# Altium schematic sheet Block-scheme.SchDoc
size 594 x 420 mm; SheetNumber: 1; SheetTotal: 2
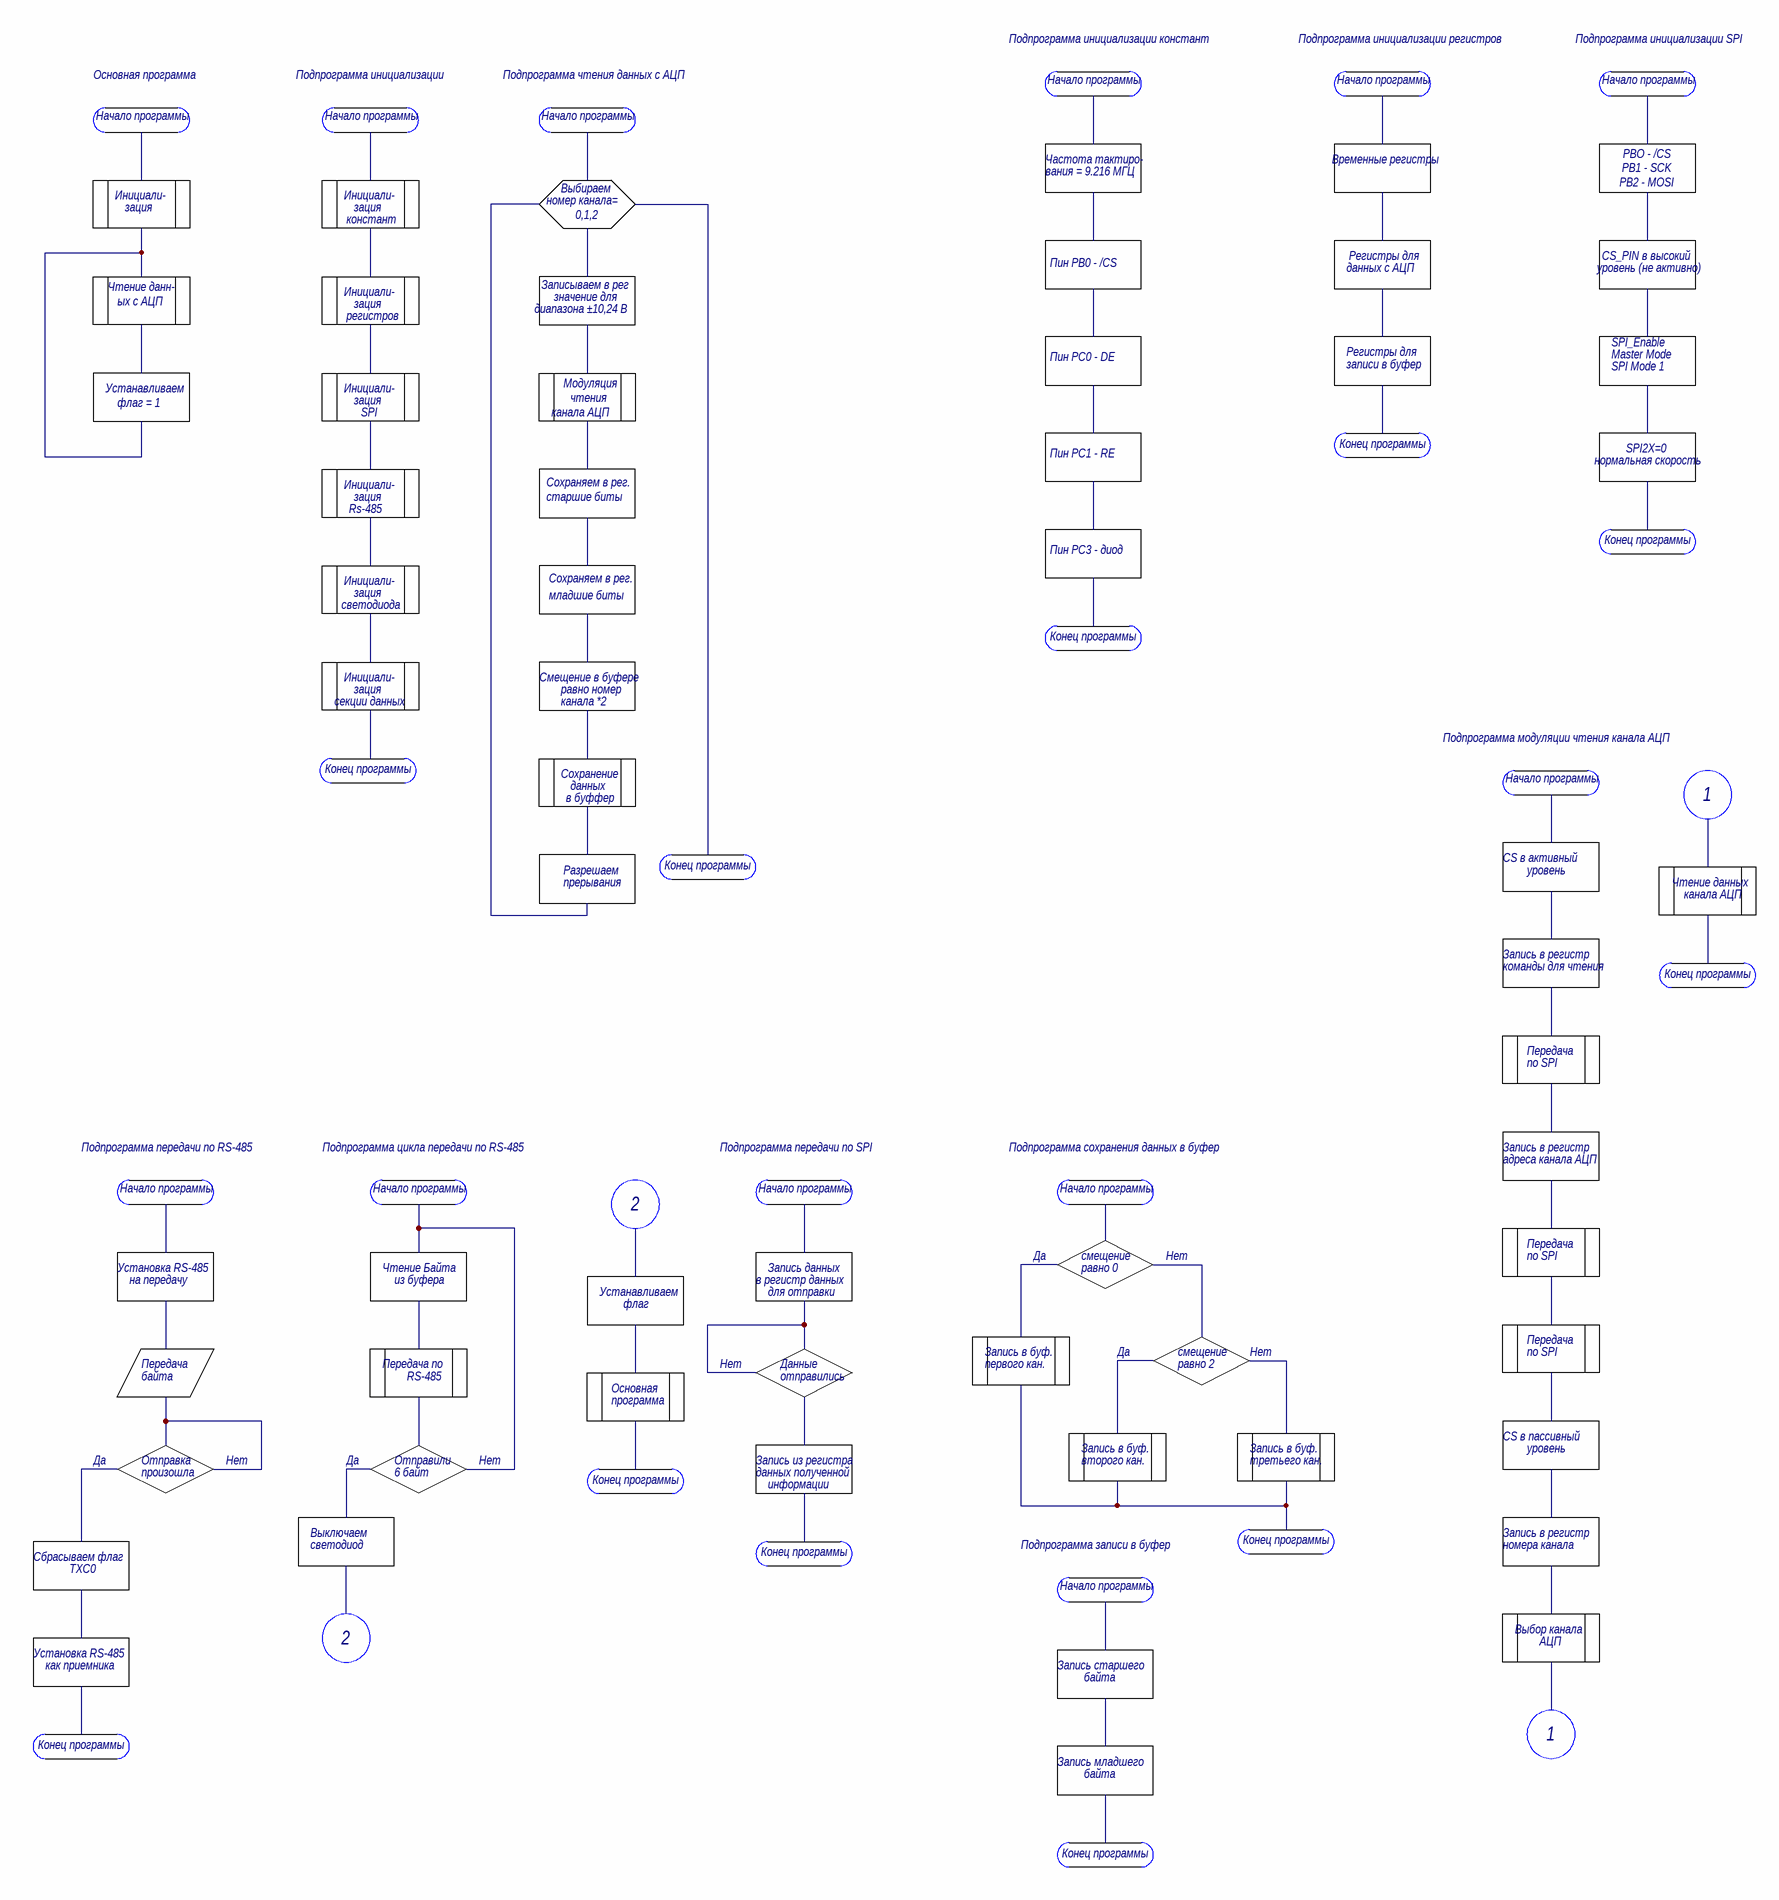
[diagram p0: Block-scheme.SchDoc, left]
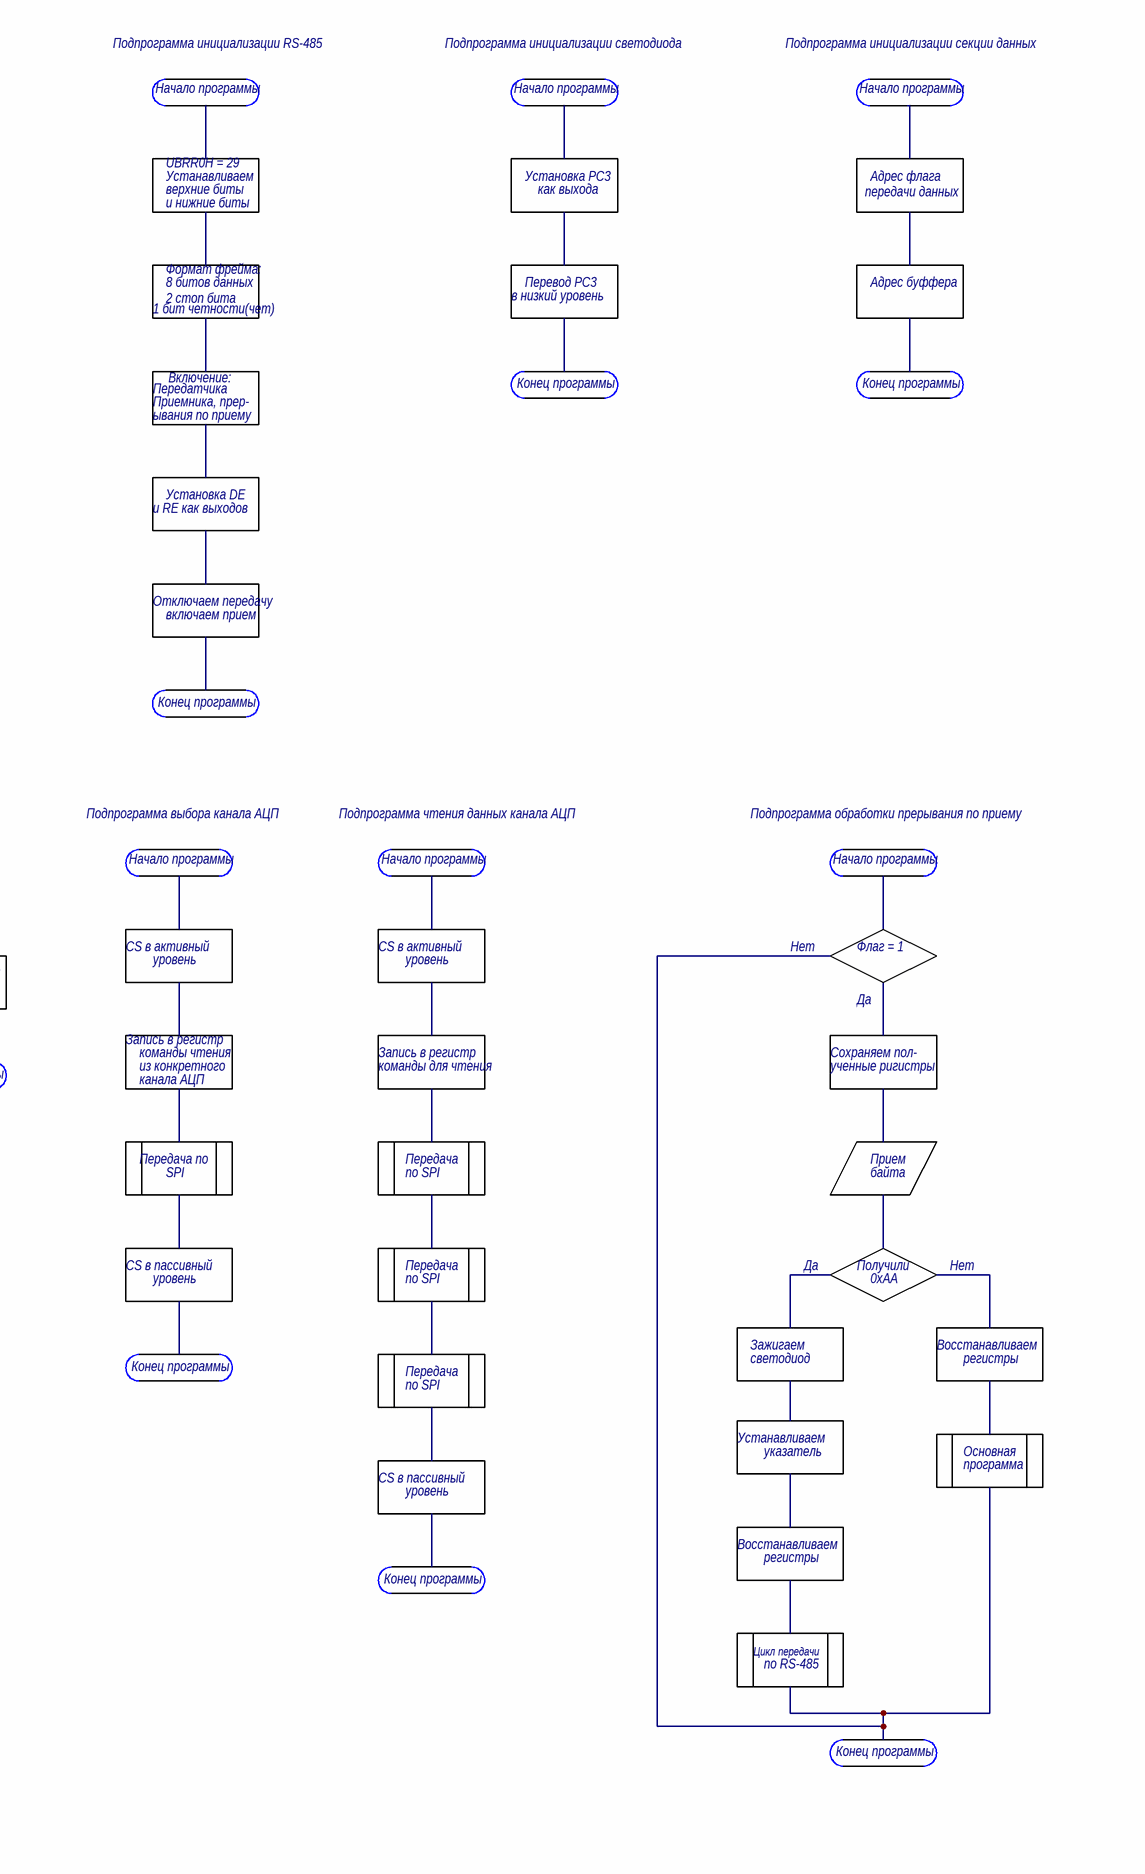
[diagram p1: Block-scheme.SchDoc, right]

## Parts
(Parts that share a designator on the sheet are numbered #1, #2 ... from top to bottom, then left to right.)
A1  Activity  (value not drawn)
A2  Activity  (value not drawn)
A3  Activity  (value not drawn)
A4  Activity  (value not drawn)
A5  Activity  (value not drawn)
A6  Activity  (value not drawn)
A7  Activity  (value not drawn)
A8  Activity  (value not drawn)
A9  Activity  (value not drawn)
A10  Activity  (value not drawn)
A11  Activity  (value not drawn)
A12  Activity  (value not drawn)
A13  Activity  (value not drawn)
A14  Activity  (value not drawn)
A16  Activity  (value not drawn)
A17  Activity  (value not drawn)
A18  Activity  (value not drawn)
A19  Activity  (value not drawn)
A20  Activity  (value not drawn)
A21  Activity  (value not drawn)
A22  Activity  (value not drawn)
A23  Activity  (value not drawn)
A24  Activity  (value not drawn)
A25  Activity  (value not drawn)
A26  Activity  (value not drawn)
A27  Activity  (value not drawn)
A28  Activity  (value not drawn)
A29  Activity  (value not drawn)
A30  Activity  (value not drawn)
A31  Activity  (value not drawn)
A32  Activity  (value not drawn)
A33  Activity  (value not drawn)
A34  Activity  (value not drawn)
A35  Activity  (value not drawn)
A?#1  Activity  (value not drawn)
A?#2  Activity  (value not drawn)
A?#3  Activity  (value not drawn)
A?#4  Activity  (value not drawn)
A?#5  Activity  (value not drawn)
A?#6  Activity  (value not drawn)
A?#7  Activity  (value not drawn)
A?#8  Activity  (value not drawn)
A?#9  Activity  (value not drawn)
A?#10  Activity  (value not drawn)
A?#11  Activity  (value not drawn)
A?#12  Activity  (value not drawn)
A?#13  Activity  (value not drawn)
A?#14  Activity  (value not drawn)
A?#15  Activity  (value not drawn)
A?#16  Activity  (value not drawn)
A?#17  Activity  (value not drawn)
A?#18  Activity  (value not drawn)
A?#19  Activity  (value not drawn)
CO1  connector  (value not drawn)
CO2  connector  (value not drawn)
CO?#1  connector  (value not drawn)
CO?#2  connector  (value not drawn)
CON2  Condition  (value not drawn)
CON3  Condition  (value not drawn)
CON4  Condition  (value not drawn)
CON?#1  Condition  (value not drawn)
CON?#2  Condition  (value not drawn)
CON?#3  Condition  (value not drawn)
CON?#4  Condition  (value not drawn)
CY1  Cycle  (value not drawn)
E1  End/Begin  (value not drawn)
E2  End/Begin  (value not drawn)
E3  End/Begin  (value not drawn)
E4  End/Begin  (value not drawn)
E5  End/Begin  (value not drawn)
E6  End/Begin  (value not drawn)
E7  End/Begin  (value not drawn)
E8  End/Begin  (value not drawn)
E9  End/Begin  (value not drawn)
E10  End/Begin  (value not drawn)
E11  End/Begin  (value not drawn)
E12  End/Begin  (value not drawn)
E13  End/Begin  (value not drawn)
E14  End/Begin  (value not drawn)
E15  End/Begin  (value not drawn)
E16  End/Begin  (value not drawn)
E17  End/Begin  (value not drawn)
E18  End/Begin  (value not drawn)
E19  End/Begin  (value not drawn)
E21  End/Begin  (value not drawn)
E22  End/Begin  (value not drawn)
E23  End/Begin  (value not drawn)
E24  End/Begin  (value not drawn)
E25  End/Begin  (value not drawn)
E26  End/Begin  (value not drawn)
E27  End/Begin  (value not drawn)
E28  End/Begin  (value not drawn)
E?#1  End/Begin  (value not drawn)
E?#2  End/Begin  (value not drawn)
E?#3  End/Begin  (value not drawn)
E?#4  End/Begin  (value not drawn)
E?#5  End/Begin  (value not drawn)
E?#6  End/Begin  (value not drawn)
E?#7  End/Begin  (value not drawn)
E?#8  End/Begin  (value not drawn)
I?#1  Input/Output  (value not drawn)
I?#2  Input/Output  (value not drawn)
P1  program  (value not drawn)
P2  program  (value not drawn)
P3  program  (value not drawn)
P4  program  (value not drawn)
P5  program  (value not drawn)
P6  program  (value not drawn)
P7  program  (value not drawn)
P8  program  (value not drawn)
P9  program  (value not drawn)
P10  program  (value not drawn)
P11  program  (value not drawn)
P12  program  (value not drawn)
P13  program  (value not drawn)
P14  program  (value not drawn)
P15  program  (value not drawn)
P16  program  (value not drawn)
P17  program  (value not drawn)
P18  program  (value not drawn)
P19  program  (value not drawn)
P?#1  program  (value not drawn)
P?#2  program  (value not drawn)
P?#3  program  (value not drawn)
P?#4  program  (value not drawn)
P?#5  program  (value not drawn)
P?#6  program  (value not drawn)
P?#7  program  (value not drawn)

## Notes on the sheet
- (near E6) Подпрограмма инициализации констант
- (near E7) Подпрограмма инициализации регистров
- (near E8) Подпрограмма инициализации SPI
- (near E9) Подпрограмма инициализации RS-485
- (near E10) Подпрограмма инициализации светодиода
- (near E12) Подпрограмма инициализации секции данных
- (near E1) Основная программа
- (near E2) Подпрограмма инициализации
- (near E4) Подпрограмма чтения данных с АЦП
- (near E6) Начало программы
- (near E7) Начало программы
- (near E8) Начало программы
- (near E9) Начало программы
- (near E10) Начало программы
- (near E12) Начало программы
- (near E1) Начало программы
- (near E2) Начало программы
- (near E4) Начало программы
- (near A5) Частота тактиро-
- (near A5) вания = 9.216 МГЦ
- (near A10) Временные регистры
- (near A19) Устанавливаем
- (near A19) верхние биты
- UBRR0H = 29
- (near A24) Установка PC3
- (near A24) как выхода
- (near A13) Адрес флага
- (near P1) Инициали-
- (near P1) зация
- (near P3) Инициали-
- (near P3) констант
- (near P3) зация
- (near CY1) номер канала=
- (near CY1) Выбираем
- (near CY1) 0,1,2
- (near A19) и нижние биты
- (near A13) передачи данных
- (near P2) Чтение данн-
- (near P4) Инициали-
- (near A1) Записываем в рег
- (near A6) Пин PB0 - /CS
- (near A11) данных с АЦП
- (near A11) Регистры для
- (near A16) уровень (не активно)
- (near A16) CS_PIN в высокий
- (near A20) 1 бит четности(чет)
- (near A20) 2 стоп бита
- Формат фрейма:
- (near A20) 8 битов данных
- (near A25) в низкий уровень
- (near A25) Перевод PC3
- (near A14) Адрес буффера
- (near P2) ых с АЦП
- (near P4) регистров
- (near P4) зация
- (near A1) диапазона ±10,24 В
- (near A1) значение для
- (near A12) Регистры для
- SPI_Enable
- (near A17) Master Mode
- (near A21) Передатчика
- Включение:
- (near E17) Конец программы
- (near E14) Конец программы
- (near A?#2) Устанавливаем
- (near A?#2) флаг = 1
- (near P5) Инициали-
- (near P5) зация
- (near P5) SPI
- (near P8) канала АЦП
- Модуляция
- (near P8) чтения
- (near A7) Пин PC0 - DE
- (near A12) записи в буфер
- (near A17) SPI Mode 1
- (near A21) Приемника, прер-
- (near A21) ывания по приему
- (near A8) Пин PC1 - RE
- (near E13) Конец программы
- (near A18) нормальная скорость
- (near A18) SPI2X=0
- (near A22) и RE как выходов
- (near A22) Установка DE
- (near P6) Инициали-
- (near P6) Rs-485
- (near P6) зация
- (near A2) Сохраняем в рег.
- (near A2) старшие биты
- (near E15) Конец программы
- (near P7) Инициали-
- (near P7) зация
- (near A3) Сохраняем в рег.
- (near A3) младшие биты
- (near A9) Пин PC3 - диод
- (near A23) Отключаем передачу
- (near A23) включаем прием
- (near P7) светодиода
- (near E11) Конец программы
- (near E16) Конец программы
- (near P10) секции данных
- (near P10) Инициали-
- (near P10) зация
- (near A4) Смещение в буфере
- (near A4) равно номер
- (near A4) канала *2
- (near E3) Конец программы
- (near P9) Сохранение
- Подпрограмма модуляции чтения канала АЦП
- (near E18) Начало программы
- (near E25) Подпрограмма выбора канала АЦП
- (near E25) Начало программы
- (near E27) Подпрограмма чтения данных канала АЦП
- (near E27) Начало программы
- (near E?#1) Подпрограмма обработки прерывания по приему
- (near E?#1) Начало программы
- (near P9) в буффер
- (near P9) данных
- (near CO2) 1
- Разрешаем
- прерывания
- (near E5) Конец программы
- (near A26) CS в активный
- (near A26) уровень
- (near P15) Чтение данных
- (near P15) канала АЦП
- (near A33) CS в активный
- (near A33) уровень
- (near A?#3) CS в активный
- (near A?#3) уровень
- (near CON?#1) Нет
- (near CON?#1) Флаг = 1
- (near CON?#1) Да
- (near A27) Запись в регистр
- (near A27) команды для чтения
- Запись в регистр
- (near A34) команды чтения
- (near A34) из конкретного
- (near A?#5) Запись в регистр
- (near A?#5) команды для чтения
- (near A?#6) Сохраняем пол-
- (near A?#6) ученные ригистры
- (near E22) Конец программы
- (near A34) канала АЦП
- (near P11) Передача
- (near P11) по SPI
- (near P19) Передача по
- (near P19) SPI
- (near P?#1) Передача
- (near P?#1) по SPI
- Прием
- (near I?#1) байта
- (near E?#2) Подпрограмма передачи по RS-485
- (near E?#3) Подпрограмма цикла передачи по RS-485
- (near E24) Подпрограмма передачи по SPI
- (near E19) Подпрограмма сохранения данных в буфер
- (near A28) Запись в регистр
- (near A35) CS в пассивный
- (near P?#2) Передача
- (near CON?#2) Да
- (near CON?#2) Получили
- Нет
- (near E?#2) Начало программы
- (near E?#3) Начало программы
- (near CO?#1) 2
- (near E24) Начало программы
- (near E19) Начало программы
- (near A28) адреса канала АЦП
- (near A35) уровень
- (near P?#2) по SPI
- (near CON?#2) 0хАА
- (near A?#9) Установка RS-485
- (near A?#10) Чтение Байта
- (near A31) Запись данных
- (near CON2) Да
- смещение
- (near CON2) равно 0
- (near P12) Передача
- (near P12) по SPI
- (near E26) Конец программы
- (near P?#3) Передача
- (near P?#3) по SPI
- Зажигаем
- (near A?#7) светодиод
- (near A?#8) Восстанавливаем
- (near A?#8) регистры
- (near A?#9) на передачу
- (near A?#10) из буфера
- (near A?#11) Устанавливаем
- (near A?#11) флаг
- (near A31) в регистр данных
- (near A31) для отправки
- (near A?#12) Устанавливаем
- (near A?#12) указатель
- (near P?#4) Основная
- (near P?#4) программа
- (near I?#2) Передача
- (near I?#2) байта
- (near P?#5) Передача по
- (near P?#5) RS-485
- (near P?#6) Основная
- (near CON4) Нет
- (near CON4) Данные
- (near CON4) отправились
- (near P16) Запись в буф.
- (near P16) первого кан.
- (near CON3) Да
- (near CON3) смещение
- (near CON3) равно 2
- (near P13) Передача
- (near P13) по SPI
- (near A?#13) CS в пассивный
- (near A?#13) уровень
- (near P?#6) программа
- (near P17) Запись в буф.
- (near P18) Запись в буф.
- (near A29) CS в пассивный
- (near A29) уровень
- (near E28) Конец программы
- (near A?#14) Восстанавливаем
- (near A?#14) регистры
- (near CON?#3) Да
- (near CON?#3) Отправка
- (near CON?#3) произошла
- (near CON?#4) Да
- (near CON?#4) Отправили
- (near CON?#4) 6 байт
- (near E?#4) Конец программы
- (near A32) Запись из регистра
- (near A32) данных полученной
- (near A32) информации
- (near P17) второго кан.
- (near P18) третьего кан.
- (near P?#7) Цикл передачи
- (near P?#7) по RS-485
- (near A?#16) Сбрасываем флаг
- (near A?#16) TXC0
- Выключаем
- (near A?#15) светодиод
- (near E23) Конец программы
- Подпрограмма записи в буфер
- (near E21) Конец программы
- (near A30) Запись в регистр
- (near A30) номера канала
- (near CO?#2) 2
- (near E?#5) Начало программы
- (near P14) Выбор канала
- (near P14) АЦП
- (near E?#6) Конец программы
- (near A?#17) Установка RS-485
- (near A?#17) как приемника
- (near A?#18) Запись старшего
- (near A?#18) байта
- (near E?#7) Конец программы
- (near A?#19) Запись младшего
- (near CO1) 1
- (near A?#19) байта
- (near E?#8) Конец программы
- Перв. примен.
- Справ. №
- Подп. дата
- Инв. № дубл.
- Взам. инв. №
- Подп. и дата
- Изм.
- Разраб.
- Лист
- № докум.
- Подп.
- Дата
- Лит.
- Масса
- Масштаб
- Пров.
- Т.контр.
- Листов
- Инв. № подл.
- Н.контр.
- Утв.
- ALTIUM GOSTBOM2.0 KEV
- Файл:
- Копировал
- Формат А2

## Library data of the parts
A?#1 = Activity: 1: PBO - /CS; 2: PB1 - SCK; 3: PB2 - MOSI
A1-A14 A16-A35 A?#2-A?#19 = Activity: Parameter 1: *
CON2-CON4 CON?#1-CON?#4 = Condition: Parameter 1: *
E1-E19 E21-E28 E?#1-E?#8 = End/Begin: Parameter 1: *
I?#1 I?#2 = Input/Output: Parameter 1: *
P1-P19 P?#1-P?#7 = program: Parameter 1: *